# EAGLE design ScanBook (EAGLE 8.0.0)
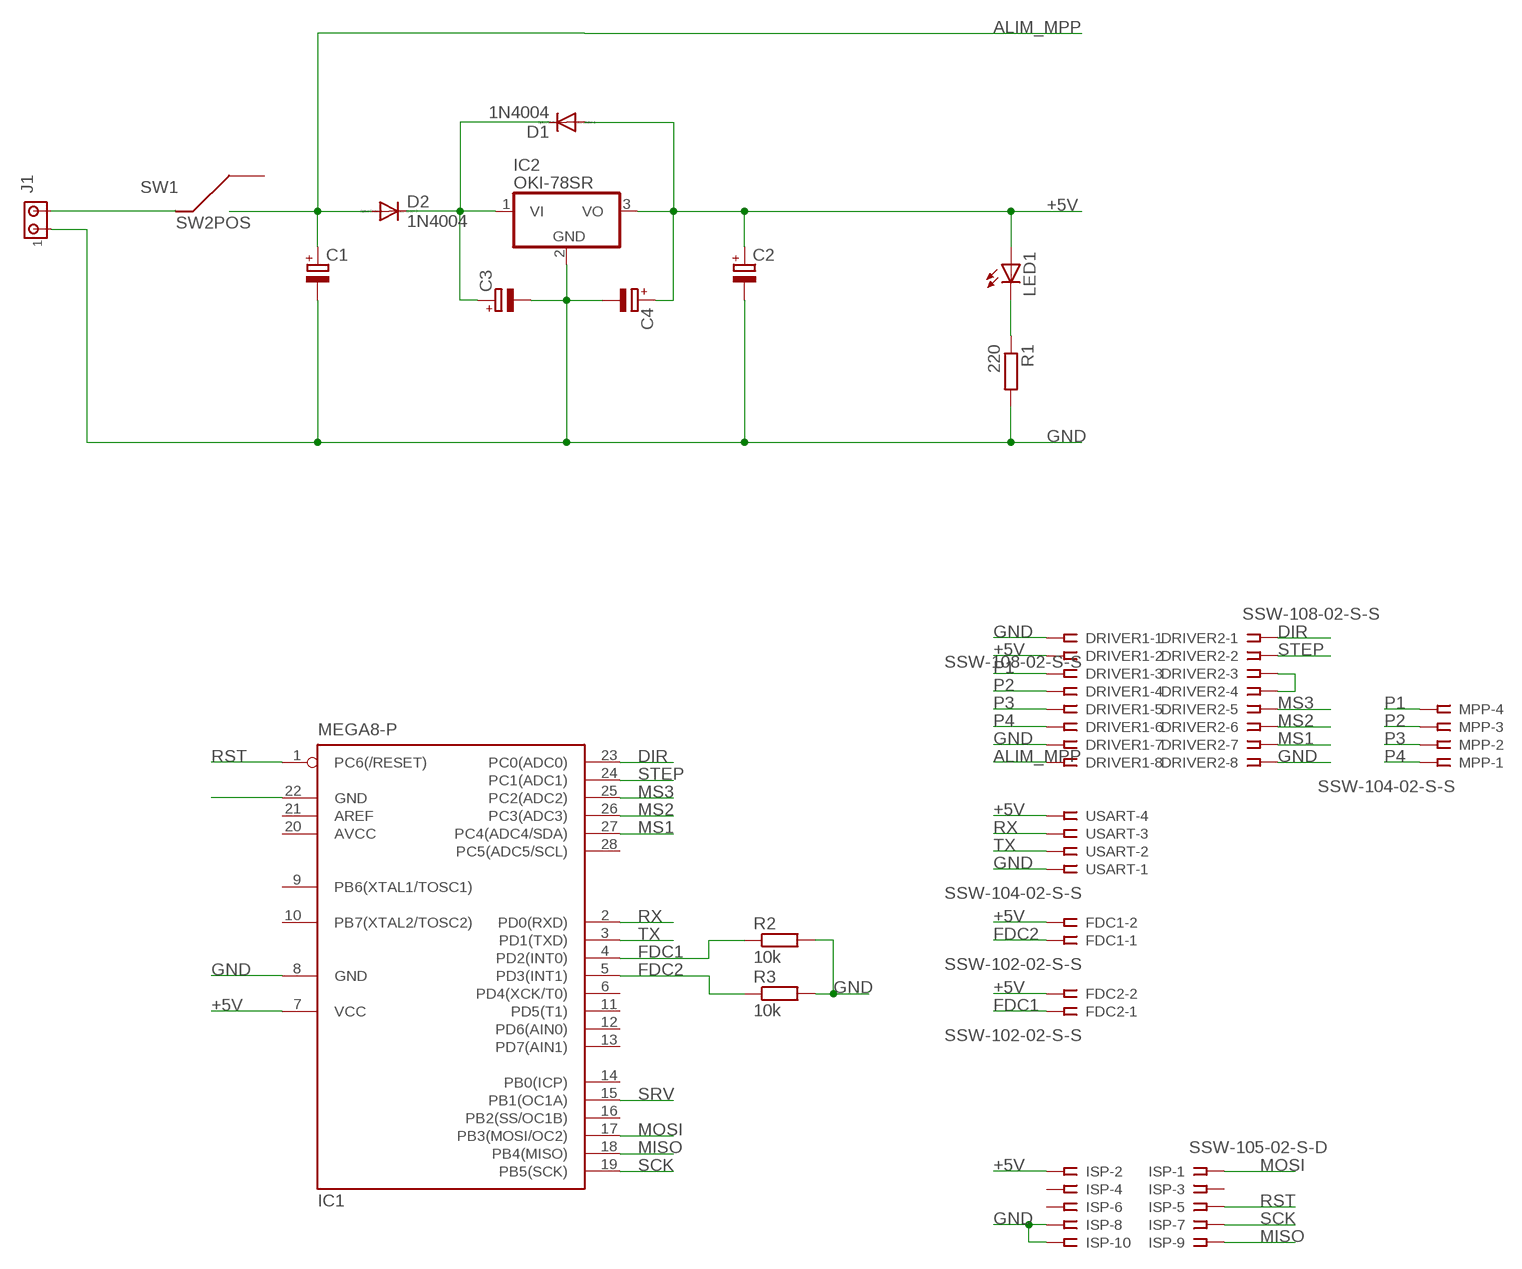
[diagram p0: schematic, sheet 1]

## Parts
C1  CPOL-EUE22-9AXIAL  [E22-9]
C2  CPOL-EUE22-9AXIAL  [E22-9]
C3  CPOL-EUTT2D4  [TT2D4]
C4  CPOL-EUTT2D4  [TT2D4]
D1  1N4004  [DO41-10]
D2  1N4004  [DO41-10]
DRIVER1  SSW-108-02-S-S  [SSW-108-02-S-S]
DRIVER2  SSW-108-02-S-S  [SSW-108-02-S-S]
FDC1  SSW-102-02-S-S  [SSW-102-02-S-S]
FDC2  SSW-102-02-S-S  [SSW-102-02-S-S]
IC1  MEGA8-P  [DIL28-3]
IC2  OKI-78SR  7805TV  [TO220V]
ISP  SSW-105-02-S-D  [SSW-105-02-S-D]
J1  MTA02-156  [1X2MTA]
LED1  LED3MM  [LED3MM]
MPP  SSW-104-02-S-S  [SSW-104-02-S-S]
R1  220  R-EU_0207/10  [0207/10]
R2  10k  R-EU_0207/10  [0207/10]
R3  10k  R-EU_0207/10  [0207/10]
SW1  SW2POS  [SW2POS]
USART  SSW-104-02-S-S  [SSW-104-02-S-S]

## Nets
+5V: C2.+ C4.+ D1.A DRIVER1.2 FDC1.2 FDC2.2 IC1.7(VCC) IC2.3(VO) ISP.2 LED1.A USART.4
ALIM_MPP: C1.+ D2.A DRIVER1.8 SW1.3
DIR: DRIVER2.1 IC1.23(PC0(ADC0))
FDC1: FDC2.1 IC1.4(PD2(INT0)) R2.1
FDC2: FDC1.1 IC1.5(PD3(INT1)) R3.1
GND: C1.- C2.- C3.- C4.- DRIVER1.1 DRIVER1.7 DRIVER2.8 IC1.8(GND) IC2.2(GND) ISP.8 ISP.10 J1.1 R1.2 R2.2 R3.2 USART.1
MISO: IC1.18(PB4(MISO)) ISP.9
MOSI: IC1.17(PB3(MOSI/OC2)) ISP.1
MS1: DRIVER2.7 IC1.27(PC4(ADC4/SDA))
MS2: DRIVER2.6 IC1.26(PC3(ADC3))
MS3: DRIVER2.5 IC1.25(PC2(ADC2))
N$1: J1.2 SW1.2
N$3: C3.+ D1.C D2.C IC2.1(VI)
N$4: IC1.22(GND)
N$8: LED1.K(C) R1.1
N$21: DRIVER2.3 DRIVER2.4
P1: DRIVER1.3 MPP.4
P2: DRIVER1.4 MPP.3
P3: DRIVER1.5 MPP.2
P4: DRIVER1.6 MPP.1
RST: IC1.1(PC6(/RESET)) ISP.5
RX: IC1.2(PD0(RXD)) USART.3
SCK: IC1.19(PB5(SCK)) ISP.7
SRV: IC1.15(PB1(OC1A))
STEP: DRIVER2.2 IC1.24(PC1(ADC1))
TX: IC1.3(PD1(TXD)) USART.2
Unconnected: IC1.6(PD4(XCK/T0)) IC1.9(PB6(XTAL1/TOSC1)) IC1.10(PB7(XTAL2/TOSC2)) IC1.11(PD5(T1)) IC1.12(PD6(AIN0)) IC1.13(PD7(AIN1)) IC1.14(PB0(ICP)) IC1.16(PB2(SS/OC1B)) IC1.21(AREF) IC1.28(PC5(ADC5/SCL)) ISP.3 ISP.4 ISP.6 SW1.1

## Power pins joined to a net without a drawn wire
AVCC: IC1.20(AVCC)

## Library data of the parts
C1-C4 = resistor:CPOL-EU: POLARIZED CAPACITOR, European symbol
D1 D2 = diode:1N4004: DIODE general purpose rectifier, 1 A
DRIVER1 DRIVER2 = con-samtec:SSW-108-02-S-S: THROUGH-HOLE .025" SQ POST SOCKET Source: Samtec SSW.pdf; MPN: SSW-108-02-S-S; OC_FARNELL: unknown; OC_NEWARK: 11P9448
FDC1 FDC2 = con-samtec:SSW-102-02-S-S: THROUGH-HOLE .025" SQ POST SOCKET Source: Samtec SSW.pdf; MPN: SSW-102-02-S-S; OC_FARNELL: unknown; OC_NEWARK: 11P9351
IC1 = atmel:MEGA8-P: MICROCONTROLLER 8 Kbytes FLASH, 1 kbytes SRAM, 512 bytes EEPROM, USART, 4-channel 10 bit ADC, 2-channel 8 bit ADC Pin compatible with Atmega48, ATMega88, ATMega168 Source: avr.lbr; OC_FARNELL: unknown; OC_NEWARK: unknown
IC2 = linear:78*: Positive VOLTAGE REGULATOR Source: http://cache.national.com/ds/LM/LM78L05.pdf http://www.fairchildsemi.com/ds/LM/LM7805.pdf
ISP = con-samtec:SSW-105-02-S-D: THROUGH-HOLE .025" SQ POST SOCKET Source: Samtec SSW.pdf; MPN: SSW-105-02-S-D; OC_FARNELL: unknown; OC_NEWARK: 11P9398
J1 = con-amp:MTA02-156: AMP connector
LED1 = led:LED: LED OSRAM: - CHIPLED LG R971, LG N971, LY N971, LG Q971, LY Q971, LO R971, LY R971 LH N974, LH R974 LS Q976, LO Q976, LY Q976 LO Q996 - Hyper CHIPLED LW Q18S LB Q993, LB Q99A, LB R99A - SideLED LS A670, LO A670, LY A670, LG A670, LP A670 LB A673, LV A673, LT A673, LW A673 LH A674 LY A675 LS A676, LA A676, LO A676, LY A676, LW A676 LS A679, LY A679, LG A679 - Hyper Micro SIDELED® LS Y876, LA Y876, LO Y876, LY Y876 LT Y87S - SmartLED LW L88C, LW L88S LB L89C, LB L89S, LG L890 LS L89K, LO L89K, LY L89K LS L896, LA L896, LO L896, LY L896 - TOPLED LS T670, LO T670, LY T670, LG T670, LP T670 LSG T670, LSP T670, LSY T670, LOP T670, LYG T670 LG T671, LOG T671, LSG T671 LB T673, LV T673, LT T673, LW T673 LH T674 LS T676, LA T676, LO T676, LY T676, LB T676, LH T676, LSB T676, LW T676 LB T67C, LV T67C, LT T67C, LS T67K, LO T67K, LY T67K, LW E67C LS E67B, LA E67B, LO E67B, LY E67B, LB E67C, LV E67C, LT E67C LW T67C LS T679, LY T679, LG T679 LS T770, LO T770, LY T770, LG T770, LP T770 LB T773, LV T773, LT T773, LW T773 LH T774 LS E675, LA E675, LY E675, LS T675 LS T776, LA T776, LO T776, LY T776, LB T776 LHGB T686 LT T68C, LB T68C - Hyper Mini TOPLED® LB M676 - Mini TOPLED Santana® LG M470 LS M47K, LO M47K, LY M47K Source: http://www.osram.convergy.de LUXEON: - LUMILED® LXK2-PW12-R00, LXK2-PW12-S00, LXK2-PW14-U00, LXK2-PW14-V00 LXK2-PM12-R00, LXK2-PM12-S00, LXK2-PM14-U00 LXK2-PE12-Q00, LXK2-PE12-R00, LXK2-PE12-S00, LXK2-PE14-T00, LXK2-PE14-U00 LXK2-PB12-K00, LXK2-PB12-L00, LXK2-PB12-M00, LXK2-PB14-N00, LXK2-PB14-P00, LXK2-PB14-Q00 LXK2-PR12-L00, LXK2-PR12-M00, LXK2-PR14-Q00, LXK2-PR14-R00 LXK2-PD12-Q00, LXK2-PD12-R00, LXK2-PD12-S00 LXK2-PH12-R00, LXK2-PH12-S00 LXK2-PL12-P00, LXK2-PL12-Q00, LXK2-PL12-R00 Source: www.luxeon.com KINGBRIGHT: KA-3528ASYC Source: www.kingbright.com
MPP USART = con-samtec:SSW-104-02-S-S: THROUGH-HOLE .025" SQ POST SOCKET Source: Samtec SSW.pdf; MPN: SSW-104-02-S-S; OC_FARNELL: unknown; OC_NEWARK: 11P9384
R1-R3 = resistor:R-EU_: RESISTOR, European symbol
SW1 = Perso2:SW2POS

## Board
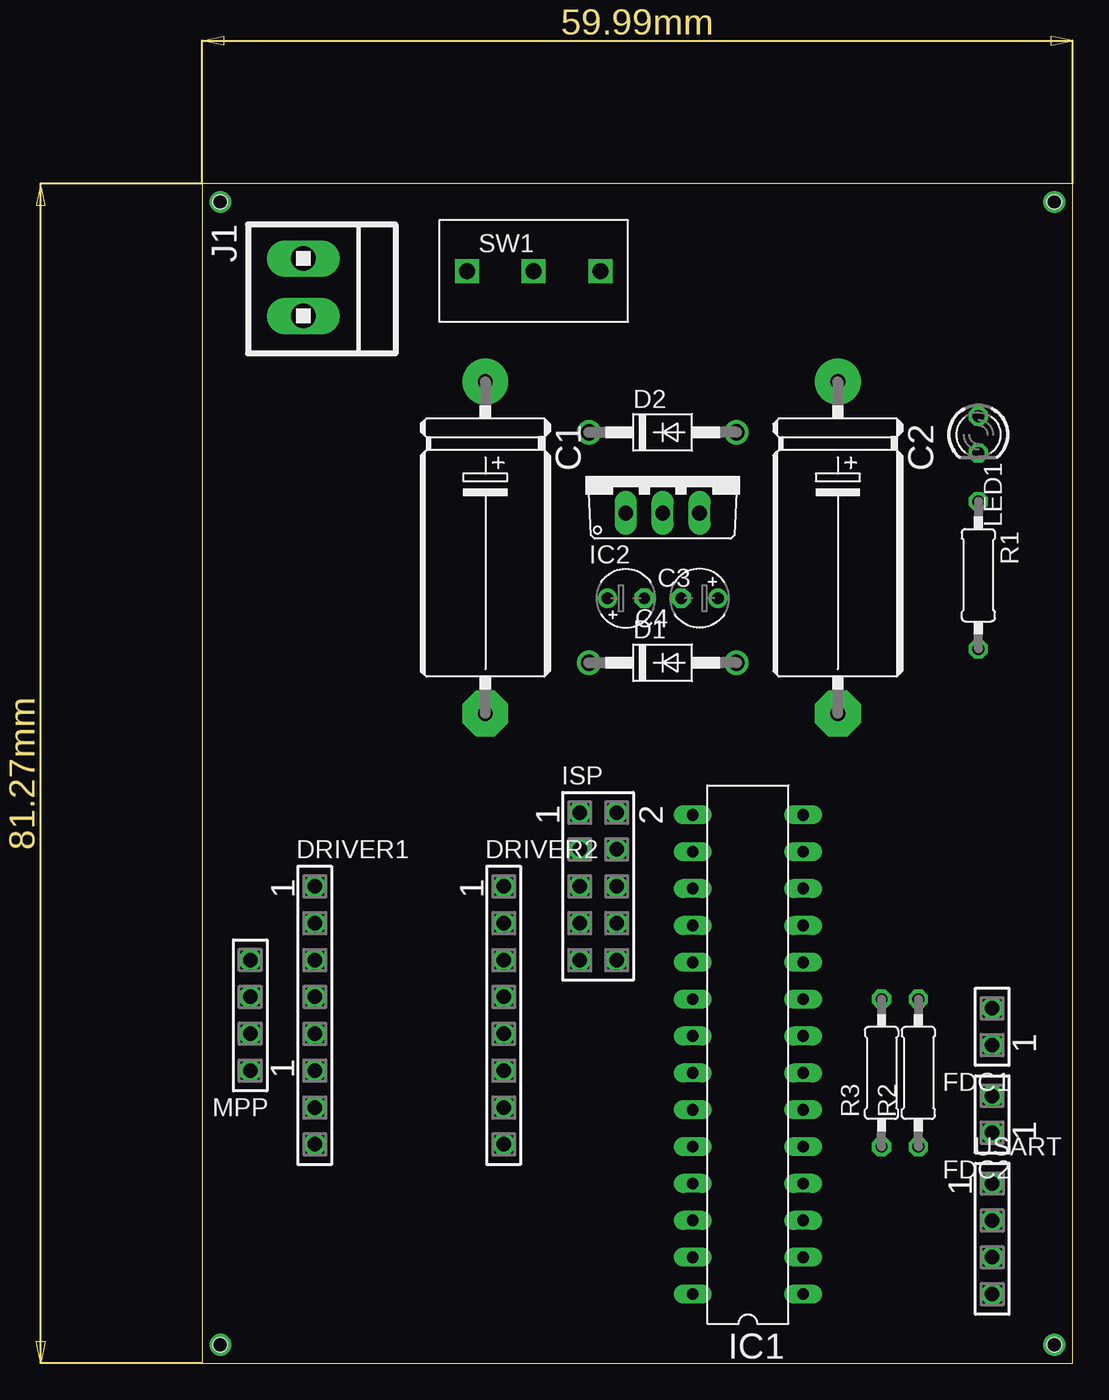
[diagram p1: board, top side]
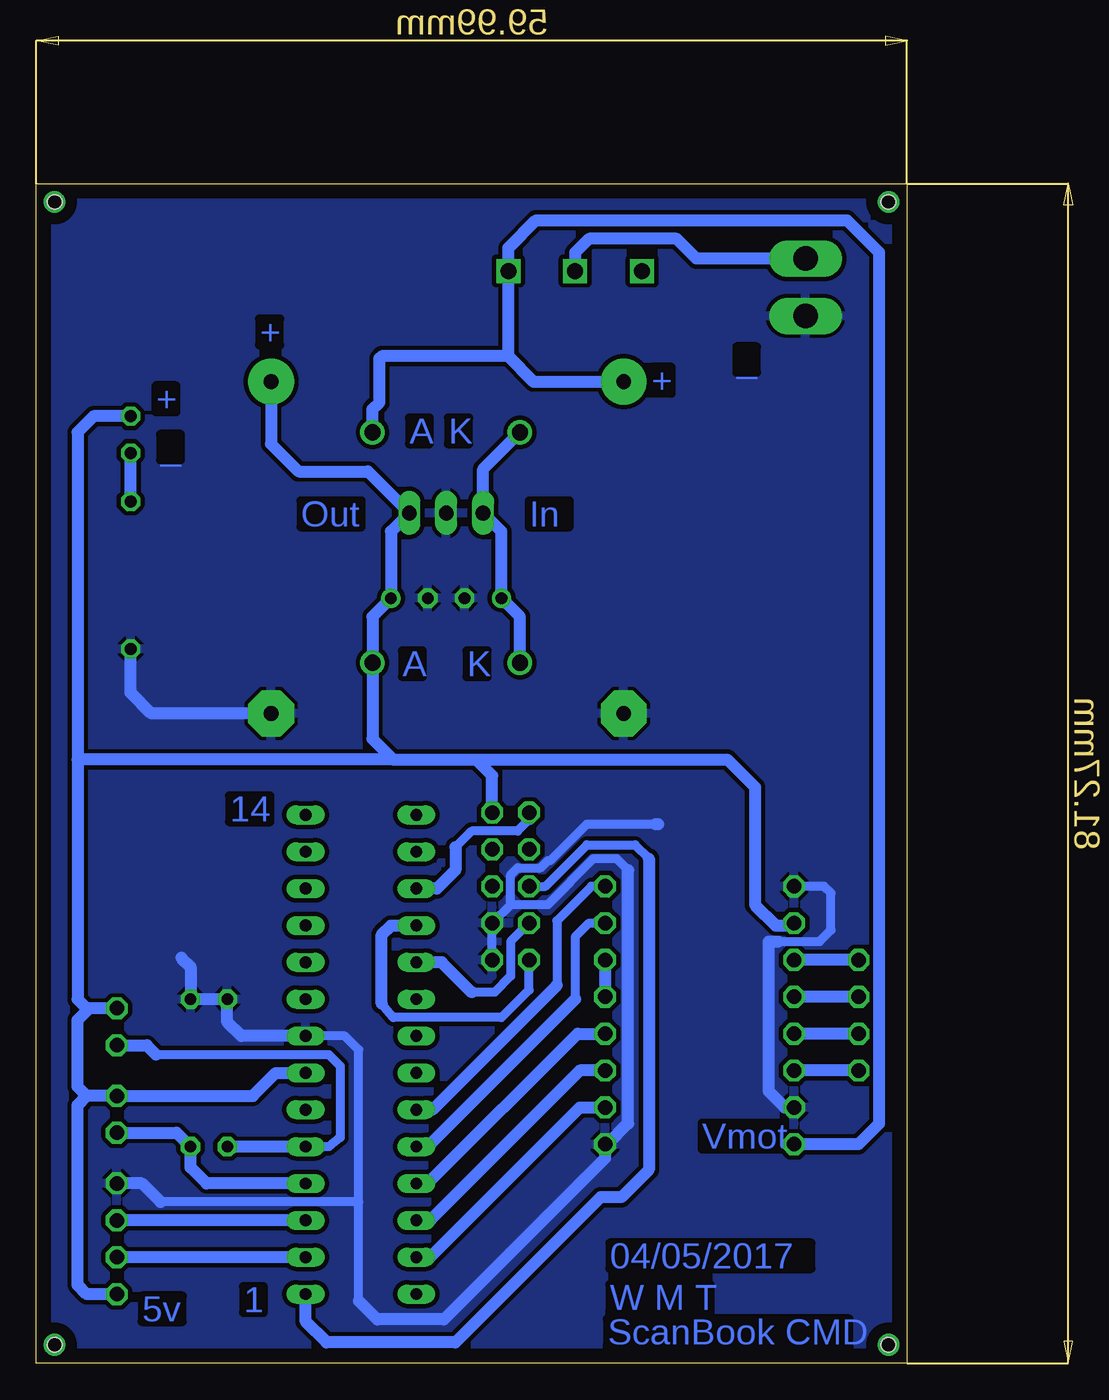
[diagram p2: board, bottom side, seen from below]

Size 59.99 x 81.27 mm. Coordinates in mm from the lower left corner, seen from the top.
Outline: 0,0 59.99,0 59.99,81.27 0,81.27 0,0
Copper layers (1*16): Top 0.035mm / dielectric 1.5mm / Bottom 0.035mm
Design rules "default": minimum track width 10mil, minimum drill 24mil, track to track 8mil, track to pad 8mil, pad to pad 8mil, via to via 8mil, smd to smd 8mil, copper to edge 40mil, drill to drill 8mil, minimum pad ring 10mil, minimum via ring 8mil, stop-mask expansion 4mil, vias tented up to drill 0mil, thermal gap 10mil
Holes 1 mm at 1.27,80.01 1.27,1.27 58.74,1.27 58.74,80.01

### Footprints (pad centres in the part's own frame; a part is rotated, then mirrored left to right if it is on the bottom)
E22-9 = drill 1.016 pad 3.15: + -11.43,0 | drill 1.016 pad 3.15 octagon: - 11.43,0
TT2D4 = drill 0.813: + -1.27,0 | drill 0.813 octagon: - 1.27,0
DO41-10 = drill 1.118: A 5.08,0; C -5.08,0
SSW-108-02-S-S = drill 1 pad 1.5 octagon: 1 -8.89,0; 2 -6.35,0; 3 -3.81,0; 4 -1.27,0; 5 1.27,0; 6 3.81,0; 7 6.35,0; 8 8.89,0
SSW-102-02-S-S = drill 1 pad 1.5 octagon: 1 -1.27,0; 2 1.27,0
DIL28-3 = drill 0.813 long: 1 -16.51,-3.81; 2 -13.97,-3.81; 3 -11.43,-3.81; 4 -8.89,-3.81; 5 -6.35,-3.81; 6 -3.81,-3.81; 7 -1.27,-3.81; 8 1.27,-3.81; 9 3.81,-3.81; 10 6.35,-3.81; 11 8.89,-3.81; 12 11.43,-3.81; 13 13.97,-3.81; 14 16.51,-3.81; 15 16.51,3.81; 16 13.97,3.81; 17 11.43,3.81; 18 8.89,3.81; 19 6.35,3.81; 20 3.81,3.81; 21 1.27,3.81; 22 -1.27,3.81; 23 -3.81,3.81; 24 -6.35,3.81; 25 -8.89,3.81; 26 -11.43,3.81; 27 -13.97,3.81; 28 -16.51,3.81
TO220V = drill 1.016 long: 1 -2.54,-2.54; 2 0,-2.54; 3 2.54,-2.54
SSW-105-02-S-D = drill 1 pad 1.5 octagon: 1 -5.08,-1.27; 2 -5.08,1.27; 3 -2.54,-1.27; 4 -2.54,1.27; 5 0,-1.27; 6 0,1.27; 7 2.54,-1.27; 8 2.54,1.27; 9 5.08,-1.27; 10 5.08,1.27
1X2MTA = drill 1.676 long: 1 1.981,0; 2 -1.981,0
LED3MM = drill 0.813 octagon: A -1.27,0; K 1.27,0
SSW-104-02-S-S = drill 1 pad 1.5 octagon: 1 -3.81,0; 2 -1.27,0; 3 1.27,0; 4 3.81,0
0207/10 = drill 0.813 octagon: 1 -5.08,0; 2 5.08,0
SW2POS = drill 1.1 square: 1 -4.604,0; 2 0,0; 3 4.604,0

### Placement (x,y rotation side)
C1  19.53,56.2 270 top
C2  43.81,56.2 270 top
C3  29.21,52.7 0 top
C4  34.29,52.7 180 top
D1  31.75,48.26 0 top
D2  31.75,64.14 0 top
DRIVER1  7.78,23.97 270 top
DRIVER2  20.8,23.97 270 top
FDC1  54.45,23.18 90 top
FDC2  54.45,17.14 90 top
IC1  37.62,21.27 90 top
IC2  31.75,61.12 0 top
ISP  27.3,32.86 270 top
J1  6.99,74.14 270 top
LED1  53.5,63.98 270 top
MPP  3.33,23.97 90 top
R1  53.5,54.29 270 top
R2  49.37,20 90 top
R3  46.83,20 90 top
SW1  22.86,75.25 0 top
USART  54.45,8.57 270 top

### Tracks (layer width: path | path; a pad name or v marks a point on that pad's centre or on a via)
+5V
  Bottom 0.406: 56.36,24.45 56.52,24.45 | 28.57,40.48 28.57,40.64
  Bottom 0.61: DRIVER1.2 7.94,30.32
  Bottom 0.813: LED1.A 56.04,65.25 57.15,64.14 57.15,41.59 | FDC1.2 56.36,24.45 57.15,23.65 57.15,19.05 56.52,18.41 | 56.52,24.45 57.15,25.08 57.15,41.59 | 56.52,18.41 FDC2.2 45.09,18.41 43.5,20 IC1.7 | USART.4 56.52,4.76 57.15,5.4 57.15,17.78 56.52,18.41 | ISP.2 28.57,40.48 29.69,41.59 | 35.4,41.59 29.69,41.59 | 35.4,41.59 57.15,41.59 | C2.+ 43.81,63.34 41.91,61.44 37.15,61.44 IC2.3 35.56,57.31 C4.+ 36.83,51.44 D1.A 36.83,43.02 35.4,41.59 | DRIVER1.2 7.94,30.16 9.05,30.16 10.48,31.59 10.48,39.69 12.38,41.59 29.69,41.59
ALIM_MPP
  Bottom 0.61: 36.2,69.37 36.35,69.22
  Bottom 0.813: DRIVER1.8 3.33,15.08 1.91,16.51 1.91,76.52 4.13,78.74 25.56,78.74 27.46,76.83 SW1.3 27.46,69.37 | C1.+ 25.72,67.63 27.46,69.37 | D2.A 36.83,65.72 36.35,66.2 36.35,69.22 | 27.46,69.37 36.2,69.37
DIR
  Bottom 0.406: 32.7,17.46 IC1.23
  Bottom 0.61: DRIVER2.1 21.75,32.86 24.13,30.48 24.13,26.04
  Bottom 0.813: 24.13,26.04 32.7,17.46
FDC1
  Bottom 0.813: IC1.4 48.26,12.38 49.37,13.49 R2.1 50.32,15.88 FDC2.1
FDC2
  Bottom 0.61: 51.75,21.27 39.85,21.27 39.05,20.48 39.05,15.56 39.85,14.92 IC1.5
  Bottom 0.813: IC1.5 R3.1 | FDC1.1 52.39,21.91 51.75,21.27
GND
  Bottom 0.406: 24.77,34.61 24.61,34.61
  Bottom 0.61: 37.78,11.11 51.44,11.11 | 8.89,29.05 6.03,29.05 5.24,29.84 5.24,32.38 5.71,32.86 DRIVER1.1 | 19.21,33.97 20,34.77 21.59,34.77 24.77,31.59 27.3,31.59 | 37.78,4.29 37.78,11.11 | 37.78,11.11 37.78,21.59 38.73,22.54 IC1.8 | 27.3,31.59 ISP.8 ISP.10 | 27.3,31.59 27.3,33.66 26.83,34.13 25.24,34.13 24.77,34.61 | 24.61,34.61 22.07,37.15 17.3,37.15
  Bottom 0.813: C2.- 52.07,44.77 53.5,46.2 R1.2 | IC1.8 45.88,22.54 46.83,23.5 R3.2 R2.2 49.37,27.3 50.01,27.94 | 51.44,11.11 52.7,12.38 USART.1 | 19.21,33.97 19.21,16.51 20.64,15.08 DRIVER2.8 20.8,14.13 31.91,3.02 36.51,3.02 37.78,4.29 | DRIVER1.7 8.41,17.62 9.53,18.73 9.53,29.05 8.89,29.05 | 17.3,37.15 17.14,37.15
  pour Bottom (isolate 0.305): 0,0 60.01,0 60.01,81.28 0,81.28 0,81.12
MISO
  Bottom 0.61: 36.2,24.77 35.4,23.81 27.94,23.81 26.04,25.72 ISP.9
  Bottom 0.813: IC1.18 35.56,30.16 36.2,29.53 36.2,24.77
MOSI
  Bottom 0.61: 26.04,37.47 26.83,36.67 30,36.67 31.11,35.56
  Bottom 0.813: ISP.1 26.04,37.47 | 31.11,35.56 31.11,33.97 32.38,32.7 IC1.17
MS1
  Bottom 0.406: IC1.27 32.86,7.3
  Bottom 0.813: 32.86,7.3 22.54,17.62 DRIVER2.7
MS2
  Bottom 0.406: 32.86,9.84 IC1.26
  Bottom 0.813: DRIVER2.6 22.54,20.16 32.86,9.84
MS3
  Bottom 0.406: IC1.25 33.02,12.38
  Bottom 0.813: 33.02,12.38 22.7,22.7 DRIVER2.5
N$1
  Bottom 0.813: J1.2 14.52,76.12 15.88,77.47 21.91,77.47 22.86,76.52 SW1.2
N$3
  Bottom 0.813: D2.C 29.21,61.59 IC2.1 27.94,57.31 C3.+ 26.67,51.44 D1.C
N$6  (via drill 1)
  other vias: 1.27,1.27
N$7  (via drill 1)
  other vias: 1.27,80.01
N$8
  Bottom 0.813: R1.1 LED1.K
N$9  (via drill 1)
  other vias: 58.74,80.01
N$10  (via drill 1)
  other vias: 58.74,1.27
N$21
  Bottom 0.813: DRIVER2.3 DRIVER2.4
P1
  Bottom 0.813: MPP.4 DRIVER1.3
P2
  Bottom 0.813: MPP.3 DRIVER1.4
P3
  Bottom 0.813: MPP.2 DRIVER1.5
P4
  Bottom 0.813: MPP.1 DRIVER1.6
RST
  Bottom 0.61: 17.78,34.77 18.73,35.72 22.07,35.72 24.92,32.86 ISP.5
  Bottom 0.813: 17.78,34.77 17.78,13.34 19.68,11.43 21.11,11.43 31.11,1.43 40.01,1.43 41.43,2.86 IC1.1
RX
  Bottom 0.813: IC1.2 USART.3
SCK
  Bottom 0.61: ISP.7 27.3,29.05 27.3,26.67 28.42,25.56 30,25.56
  Bottom 0.813: 30,25.56 32.07,27.62 IC1.19
STEP
  Bottom 0.406: 33.02,14.92 IC1.24
  Bottom 0.61: 22.86,25.08 22.86,29.37 21.91,30.32 DRIVER2.2
  Bottom 0.813: 22.86,25.08 33.02,14.92
TX
  Bottom 0.813: IC1.3 USART.2

### Text on the board
Bottom: + | _ | + | + | K | A | _ | In | Out | K | A | 14 | Vmot | 04/05/2017 | W M T | 1 | 5v | ScanBook CMD